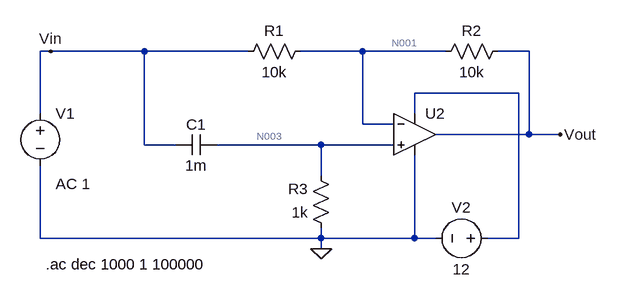
[diagram p0: schematic circuito.asc]
circuito.asc, the LTspice schematic file:
Version 4
SHEET 1 880 680
WIRE -224 80 -240 80
WIRE -80 80 -224 80
WIRE 80 80 -80 80
WIRE 256 80 160 80
WIRE 384 80 256 80
WIRE 512 80 464 80
WIRE 496 144 336 144
WIRE -240 176 -240 80
WIRE 336 176 336 144
WIRE 256 192 256 80
WIRE 304 192 256 192
WIRE 512 208 512 80
WIRE 512 208 368 208
WIRE 560 208 512 208
WIRE -80 224 -80 80
WIRE -32 224 -80 224
WIRE 192 224 32 224
WIRE 304 224 192 224
WIRE 192 272 192 224
WIRE -240 368 -240 256
WIRE 192 368 192 352
WIRE 192 368 -240 368
WIRE 336 368 336 240
WIRE 336 368 192 368
WIRE 368 368 336 368
WIRE 496 368 496 144
WIRE 496 368 448 368
WIRE 192 384 192 368
FLAG 192 384 0
FLAG 560 208 Vout
FLAG -224 80 Vin
SYMBOL res 176 64 R90
WINDOW 0 0 56 VBottom 2
WINDOW 3 32 56 VTop 2
SYMATTR InstName R1
SYMATTR Value 10k
SYMBOL res 480 64 R90
WINDOW 0 0 56 VBottom 2
WINDOW 3 32 56 VTop 2
SYMATTR InstName R2
SYMATTR Value 10k
SYMBOL res 208 368 R180
WINDOW 0 36 76 Left 2
WINDOW 3 36 40 Left 2
SYMATTR InstName R3
SYMATTR Value 1k
SYMBOL cap 32 208 R90
WINDOW 0 0 32 VBottom 2
WINDOW 3 32 32 VTop 2
SYMATTR InstName C1
SYMATTR Value 1m
SYMBOL voltage -240 160 R0
WINDOW 123 24 124 Left 2
WINDOW 39 0 0 Left 0
SYMATTR Value2 AC 1
SYMATTR InstName V1
SYMATTR Value ""
SYMBOL OpAmps\\UniversalOpAmp 336 208 R0
SYMATTR InstName U2
SYMBOL voltage 464 368 R90
WINDOW 0 -32 56 VBottom 2
WINDOW 3 32 56 VTop 2
WINDOW 123 0 0 Left 0
WINDOW 39 0 0 Left 0
SYMATTR InstName V2
SYMATTR Value 12
TEXT -232 408 Left 2 !.ac dec 1000 1 100000

The netlist it stands for:
* circuito.asc
R1 N001 Vin 10k
R2 Vout N001 10k
R3 0 N003 1k
C1 N003 Vin 1m
V1 Vin 0 AC 1
XU2 N003 N001 N002 0 Vout level1 Avol=1Meg GBW=10Meg Vos=0 En=0 Enk=0 In=0 Ink=0 Rin=500Meg  ; pins In+ In- V+ V- OUT
V2 N002 0 12
.ac dec 1000 1 100000
.lib UniversalOpAmp1.lib
.backanno
.end

* Results of the author's LTspice run, read from the files saved beside the schematic
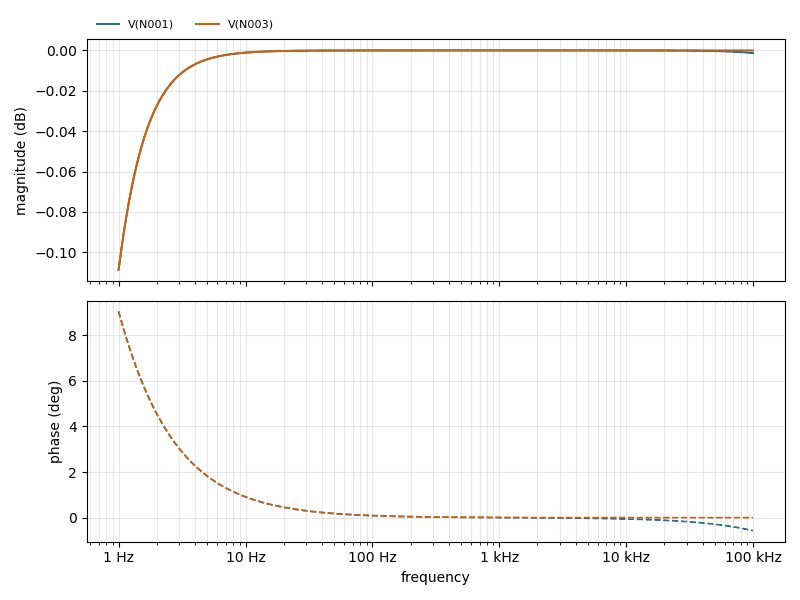
[diagram p1: AC Analysis of circuito.asc, plotted from the saved traces]
* AC Analysis, 1 run:
*   V(N001): -0.11 dB at 1 Hz, -0.00 dB at 100 kHz, peak -0.00 dB at 959.4 Hz
*   V(N003): -0.11 dB at 1 Hz, -0.00 dB at 100 kHz, peak -0.00 dB at 100 kHz